# Altium schematic sheet JTAG.SchDoc
size 297 x 209 mm; SheetNumber: 1; SheetTotal: 3
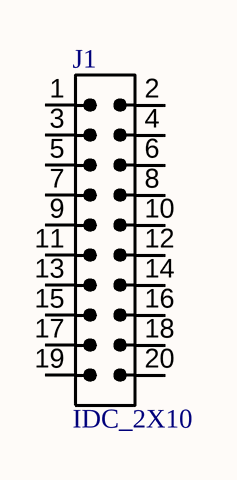
[diagram p0: JTAG.SchDoc]

## Parts
J1  IDC_2X10  [IDC_2X10]

## Nets

Not connected (* = marked no-connect by the designer): J1 1 2 3 4 5 6 7 8 9 10 11 12 13 14 15 16 17 18 19 20

## Notes on the sheet
- Drawn
- Name
- Date
- Drawing Title
- Checked
- Drawing No.
- Approved
- Size
- A4
- Ver.
- Rev.
- Sheet
- Of

## Library data of the parts
J1 = IDC_2X10: CONN, IDC, Male, pitch: 2.54mm, 20POS; VALUE: IDC_2X10